# EAGLE design rapidisplay (EAGLE 8.4.3)
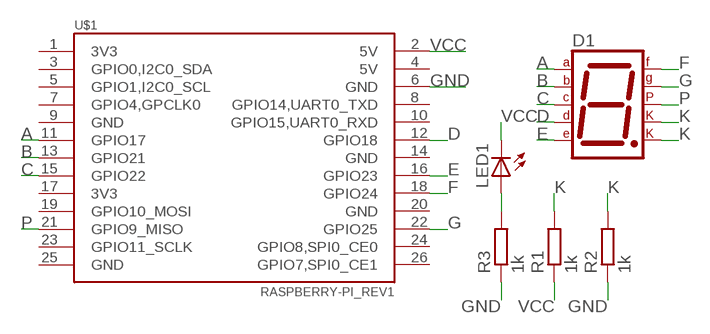
[diagram p0: schematic, sheet 1]

## Parts
D1  7SEG-CK  [7SEG-13]
LED1  LEDSML1206  [SML1206]
R1  1k  R-EU_M1206  [M1206]
R2  1k  R-EU_M1206  [M1206]
R3  1k  R-EU_M1206  [M1206]
U$1  RASPBERRY-PI_REV1  [RASPBERRY-PI_REV1]

## Nets
A: D1.7(A) U$1.11(GPIO17)
B: D1.6(B) U$1.13(GPIO21)
C: D1.4(C) U$1.15(GPIO22)
D: D1.2(D) U$1.12(GPIO18)
E: D1.1(E) U$1.16(GPIO23)
F: D1.9(F) U$1.18(GPIO24)
G: D1.10(G) U$1.22(GPIO25)
GND: R2.1 R3.1 U$1.6(GND)
K: D1.3(CK1) D1.8(CK2) R1.2 R2.2
N$1: LED1.A R3.2
P: D1.5(DP) U$1.21(GPIO9_MISO)
VCC: LED1.C R1.1 U$1.2(5V)
Unconnected: U$1.1(3V3) U$1.3(GPIO0,I2C0_SDA) U$1.4(5V) U$1.5(GPIO1,I2C0_SCL) U$1.7(GPIO4,GPCLK0) U$1.8(GPIO14,UART0_TXD) U$1.9(GND) U$1.10(GPIO15,UART0_RXD) U$1.14(GND) U$1.17(3V3) U$1.19(GPIO10_MOSI) U$1.20(GND) U$1.23(GPIO11_SCLK) U$1.24(GPIO8,SPI0_CE0) U$1.25(GND) U$1.26(GPIO7,SPI0_CE1)

## Library data of the parts
D1 = special:7SEG-CK: 7-segment DISPLAY single cathode, 13 mm
LED1 = led:LED: LED OSRAM: - CHIPLED LG R971, LG N971, LY N971, LG Q971, LY Q971, LO R971, LY R971 LH N974, LH R974 LS Q976, LO Q976, LY Q976 LO Q996 - Hyper CHIPLED LW Q18S LB Q993, LB Q99A, LB R99A - SideLED LS A670, LO A670, LY A670, LG A670, LP A670 LB A673, LV A673, LT A673, LW A673 LH A674 LY A675 LS A676, LA A676, LO A676, LY A676, LW A676 LS A679, LY A679, LG A679 - Hyper Micro SIDELED® LS Y876, LA Y876, LO Y876, LY Y876 LT Y87S - SmartLED LW L88C, LW L88S LB L89C, LB L89S, LG L890 LS L89K, LO L89K, LY L89K LS L896, LA L896, LO L896, LY L896 - TOPLED LS T670, LO T670, LY T670, LG T670, LP T670 LSG T670, LSP T670, LSY T670, LOP T670, LYG T670 LG T671, LOG T671, LSG T671 LB T673, LV T673, LT T673, LW T673 LH T674 LS T676, LA T676, LO T676, LY T676, LB T676, LH T676, LSB T676, LW T676 LB T67C, LV T67C, LT T67C, LS T67K, LO T67K, LY T67K, LW E67C LS E67B, LA E67B, LO E67B, LY E67B, LB E67C, LV E67C, LT E67C LW T67C LS T679, LY T679, LG T679 LS T770, LO T770, LY T770, LG T770, LP T770 LB T773, LV T773, LT T773, LW T773 LH T774 LS E675, LA E675, LY E675, LS T675 LS T776, LA T776, LO T776, LY T776, LB T776 LHGB T686 LT T68C, LB T68C - Hyper Mini TOPLED® LB M676 - Mini TOPLED Santana® LG M470 LS M47K, LO M47K, LY M47K Source: http://www.osram.convergy.de LUXEON: - LUMILED® LXK2-PW12-R00, LXK2-PW12-S00, LXK2-PW14-U00, LXK2-PW14-V00 LXK2-PM12-R00, LXK2-PM12-S00, LXK2-PM14-U00 LXK2-PE12-Q00, LXK2-PE12-R00, LXK2-PE12-S00, LXK2-PE14-T00, LXK2-PE14-U00 LXK2-PB12-K00, LXK2-PB12-L00, LXK2-PB12-M00, LXK2-PB14-N00, LXK2-PB14-P00, LXK2-PB14-Q00 LXK2-PR12-L00, LXK2-PR12-M00, LXK2-PR14-Q00, LXK2-PR14-R00 LXK2-PD12-Q00, LXK2-PD12-R00, LXK2-PD12-S00 LXK2-PH12-R00, LXK2-PH12-S00 LXK2-PL12-P00, LXK2-PL12-Q00, LXK2-PL12-R00 Source: www.luxeon.com KINGBRIGHT: KA-3528ASYC Source: www.kingbright.com
R1-R3 = rcl:R-EU_: RESISTOR, European symbol
U$1 = RaspberryPi:RASPBERRY-PI_REV1: Raspberry Pi Board <http://www.raspberrypi.org/> Jacques Lagnel V1.0 (beta) 2012 Mateusz Bawaj V1.1 (beta) 2012 Board dimension: Forum 3D model <http://www.raspberrypi.org/forum/general-discussion/mechanical-profile-3d-models?value=3d%20model&type=1&include=1&search=1&ret=all> The GPIO Connector (P1): http://elinux.org/RPi_Low-level_peripherals

## Board
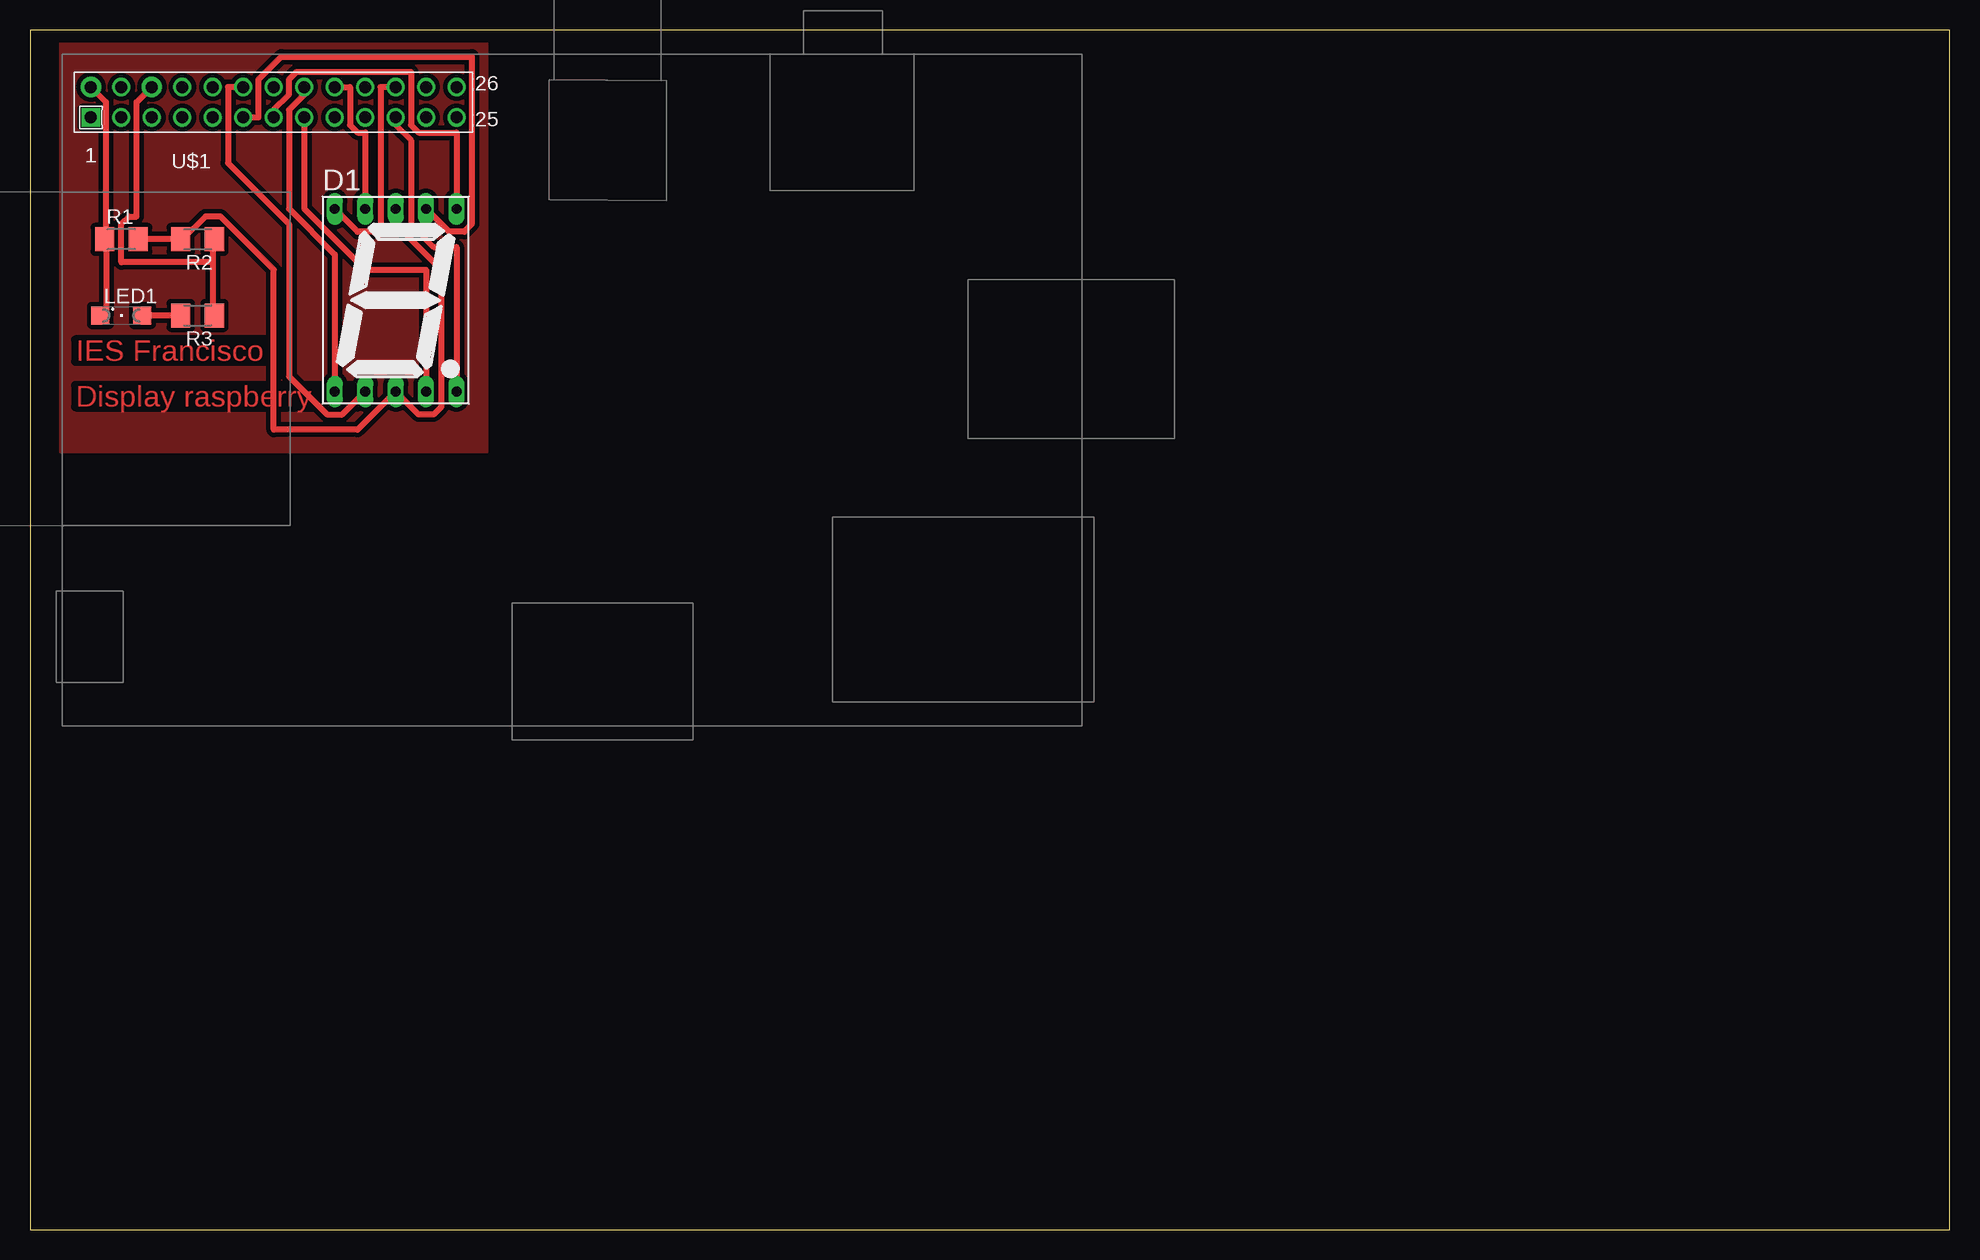
[diagram p1: board, top side]

Size 160 x 100 mm. Coordinates in mm from the lower left corner, seen from the top.
Outline: 0,0 160,0 160,100 0,100 0,0
Copper layers (1*16): Top 0.035mm / dielectric 1.5mm / Bottom 0.035mm
Design rules "default *": minimum track width 20mil, minimum drill 0.35mm, track to track 15mil, track to pad 6mil, pad to pad 6mil, via to via 6mil, smd to smd 6mil, copper to edge 40mil, drill to drill 6mil, minimum pad ring 10mil, minimum via ring 8mil, stop-mask expansion 4mil, vias tented up to drill 0mil, thermal gap 10mil

### Footprints (pad centres in the part's own frame; a part is rotated, then mirrored left to right if it is on the bottom)
7SEG-13 = drill 0.813 long: 1 -5.08,-7.62; 2 -2.54,-7.62; 3 0,-7.62; 4 2.54,-7.62; 5 5.08,-7.62; 6 5.08,7.62; 7 2.54,7.62; 8 0,7.62; 9 -2.54,7.62; 10 -5.08,7.62
SML1206 = smd 1.5 x 1.5: A 1.75,0; C -1.75,0
M1206 = smd 1.6 x 2: 1 -1.4,0; 2 1.4,0
RASPBERRY-PI_REV1 = drill 1 square: 1 -41.91,21.59 | drill 1 pad 1.676: 2 -41.91,24.13; 6 -36.83,24.13 | drill 1: 3 -39.37,21.59; 4 -39.37,24.13; 5 -36.83,21.59; 7 -34.29,21.59; 8 -34.29,24.13; 9 -31.75,21.59; 10 -31.75,24.13; 11 -29.21,21.59; 12 -29.21,24.13; 13 -26.67,21.59; 14 -26.67,24.13; 15 -24.13,21.59; 16 -24.13,24.13; 17 -21.59,21.59; 18 -21.59,24.13; 19 -19.05,21.59; 20 -19.05,24.13; 21 -16.51,21.59; 22 -16.51,24.13; 23 -13.97,21.59; 24 -13.97,24.13; 25 -11.43,21.59; 26 -11.43,24.13

### Placement (x,y rotation side)
D1  30.48,77.47 0 top
LED1  7.62,76.2 0 top
R1  7.62,82.55 0 top
R2  13.97,82.55 180 top
R3  13.97,76.2 180 top
U$1  46.99,71.12 0 top

### Tracks (layer width: path | path; a pad name or v marks a point on that pad's centre or on a via)
A
  Top 0.508: D1.7 34.92,83.19 36.2,83.19 36.83,83.82 36.83,97.79 20.95,97.79 19.05,95.89 19.05,92.71 U$1.11
B
  Top 0.508: D1.6 35.56,91.44 32.38,91.44 31.75,92.08 31.75,96.52 22.23,96.52 21.59,95.89 21.59,94.61 20.32,93.34 U$1.13
C
  Top 0.508: D1.4 33.02,80.01 27.94,80.01 22.86,85.09 U$1.15
D
  Top 0.508: D1.2 26.04,67.94 24.77,67.94 21.59,71.12 21.59,83.82 16.51,88.9 16.51,95.25 U$1.12
E
  Top 0.508: D1.1 25.4,81.28 21.59,85.09 21.59,93.34 22.86,94.61 U$1.16
F
  Top 0.508: D1.9 27.94,91.44 27.3,91.44 26.67,92.08 26.67,95.25 U$1.18
G
  Top 0.508: D1.10 27.3,83.19 28.57,83.19 29.21,83.82 29.21,95.25 U$1.22
GND
  Top 0.508: 15.24,80.64 15.24,82.55 R2.1 | 15.24,80.64 15.24,76.2 R3.1 | U$1.6 8.89,93.98 8.89,84.45 8.26,84.45 7.62,83.82 7.62,80.64 15.24,80.64
K
  Top 0.508: R1.2 R2.2 12.7,82.55 14.61,84.45 15.88,84.45 20.32,80.01 20.32,66.67 27.3,66.67 D1.3 32.38,67.94 33.66,67.94 34.29,68.58 34.29,80.64 33.66,80.64 30.48,83.82 D1.8
N$1
  Top 0.508: R3.2 LED1.A
N$2
  pour Top: 38.1,99.06 38.1,64.77 2.54,64.77 2.54,99.06
P
  Top 0.508: D1.5 35.56,81.92 33.66,81.92 31.75,83.82 31.75,90.81 30.48,92.08 U$1.21
VCC
  Top 0.508: 6.35,82.55 6.35,76.2 LED1.C | U$1.2 6.35,93.98 6.35,82.55 | 6.35,82.55 R1.1

### Text on the board
Top: IES Francisco | Display raspberry